# EAGLE design TinkerAccess RFID Adapter (EAGLE 9.6.2)
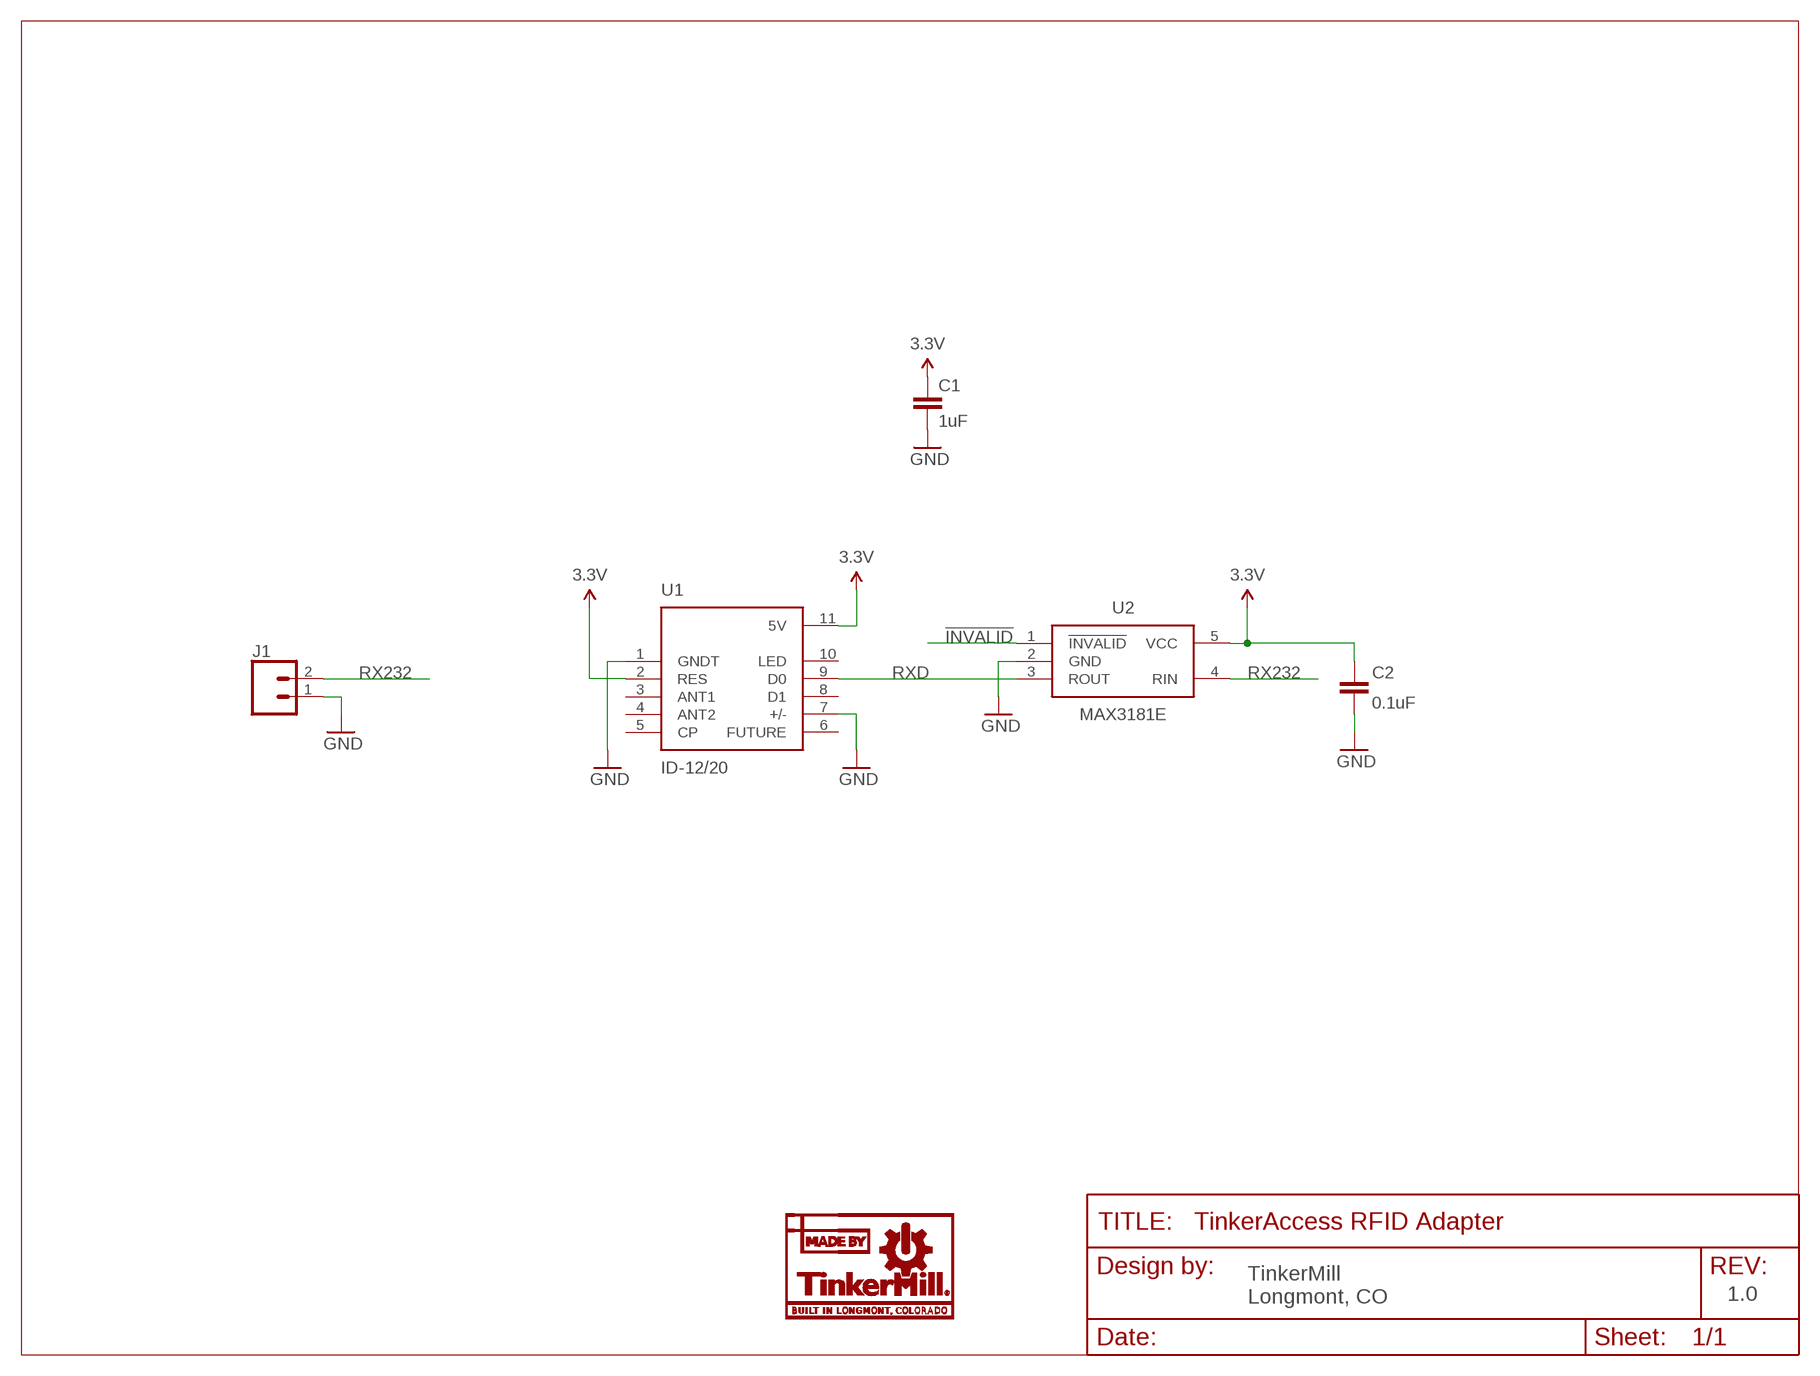
[diagram p0: schematic, sheet 1]

## Parts
C1  1uF  10UF-0603-6.3V-20%  [0603]
C2  0.1uF  0.1UF-0603-25V-(+80/-20%)  [0603]
J1  CONN_025MM  [SCREWTERMINAL-5MM-2]
LOGO1  MADE_BY_TINKERMILL  [MADE_BY_TINKERMILL]
U1  ID-12/20  [ID-12]
U2  MAX3181E  MAX3181E_SOT23-5  [SOT23-5]

## Nets
3.3V: C1.1 C2.2 U1.2(RES) U1.11(5V) U2.5(VCC)
!INVALID: U2.1(!INVALID)
GND: C1.2 C2.1 J1.1 U1.1(GNDT) U1.7(+/-) U2.2(GND)
RX232: J1.2 U2.4(RIN)
RXD: U1.9(D0) U2.3(ROUT)
Unconnected: U1.3(ANT1) U1.4(ANT2) U1.5(CP) U1.6(FUTURE) U1.8(D1) U1.10(LED)

## Notes on the sheet
- TinkerMill
  Longmont, CO
- 1.0

## Library data of the parts
C1 = SparkFun-Capacitors:10UF: 10.0µF ceramic capacitors A capacitor is a passive two-terminal electrical component used to store electrical energy temporarily in an electric field.; PROD_ID: CAP-11015; VALUE: 10uF
C2 = SparkFun-Capacitors:0.1UF: 0.1µF ceramic capacitors A capacitor is a passive two-terminal electrical component used to store electrical energy temporarily in an electric field.; PROD_ID: CAP-00810; SPICEPREFIX: C
J1 = SparkFun-Connectors:CONN_02: Multi connection point. Often used as Generic Header-pin footprint for 0.1 inch spaced/style header connections On any of the 0.1 inch spaced packages, you can populate with these: Break Away Headers - Straight <https://www.sparkfun.com/products/116> (PRT-00116) Break Away Male Headers - Right Angle <https://www.sparkfun.com/products/553> (PRT-00553) Female Headers <https://www.sparkfun.com/products/115> (PRT-00115) Break Away Headers - Machine Pin <https://www.sparkfun.com/products/117> (PRT-00117) Break Away Female Headers - Swiss Machine Pin <https://www.sparkfun.com/products/743> (PRT-00743) For SCREWTERMINALS and SPRING TERMINALS visit here: Screw Terimnals on SparkFun.com <https://www.sparkfun.com/search/results?term=Screw+Terminals> (5mm/3.5mm/2.54mm spacing) This device is also useful as a general connection point to wire up your design to another part of your project. Our various solder wires solder well into these plated through hole pads. Hook-Up Wire - Assortment (Stranded, 22 AWG) <https://www.sparkfun.com/products/11375> (PRT-11375) Hook-Up Wire - Assortment (Solid Core, 22 AWG) <https://www.sparkfun.com/products/11367> (PRT-11367) View the entire wire category on our website here <https://www.sparkfun.com/categories/141> Special notes: Molex polarized connector foot print use with: PRT-08233 with associated crimp pins and housings. 2.54_SCREWTERM for use with PRT-10571. 3.5mm Screw Terminal footprints for PRT-08084 5mm Screw Terminal footprints for use with PRT-08432; SF_SKU: PRT-08432
LOGO1 = TinkerMill:MADE_BY_TINKERMILL
U1 = SparkFun-RF:ID-12/20: RFID reader for ID2, ID12, and ID20 Package
U2 = TMF_ICs:MAX3181E; SPICEPREFIX: X

## Board
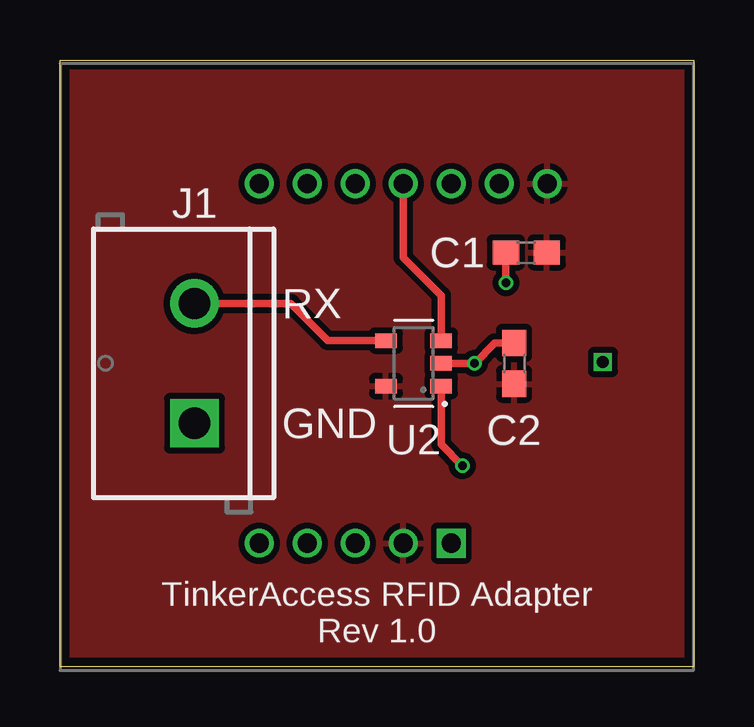
[diagram p1: board, top side]
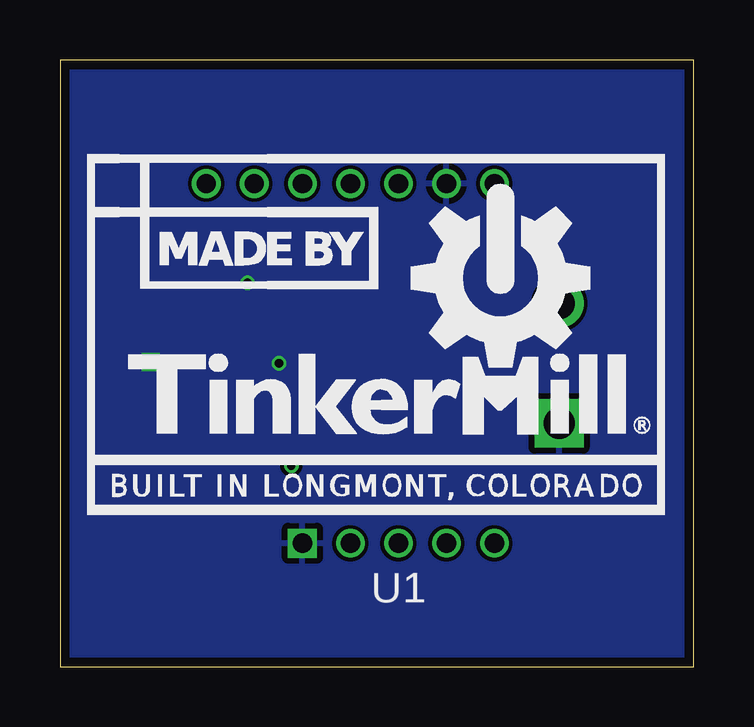
[diagram p2: board, bottom side, seen from below]

Size 26.4 x 25.3 mm. Coordinates in mm from the lower left corner, seen from the top.
Outline: 0,0 0,25.3 26.4,25.3 26.4,0 0,0
Copper layers (1*16): Top 0.035559375mm / dielectric 1.6mm / Bottom 0.035559375mm
Design rules "oshpark-2layer": minimum track width 6mil, minimum drill 10mil, track to track 6mil, track to pad 6mil, pad to pad 6mil, via to via 6mil, smd to smd 6mil, copper to edge 15mil, drill to drill 6mil, minimum pad ring 5mil, minimum via ring 5mil, stop-mask expansion 2.5mil, vias tented up to drill 0mil, thermal gap 10mil

### Footprints (pad centres in the part's own frame; a part is rotated, then mirrored left to right if it is on the bottom)
0603 = smd 1.1 x 1: 1 -0.85,0; 2 0.85,0
SCREWTERMINAL-5MM-2 = drill 1.3 pad 2.032 square: 1 0,0 | drill 1.3 pad 2.032: 2 5,0
ID-12 = drill 0.8 square: 1 16.255,5.32 | drill 0.8: 2 14.255,5.32; 3 12.255,5.32; 4 10.255,5.32; 5 8.255,5.32; 6 8.255,20.32; 7 10.255,20.32; 8 12.255,20.32; 9 14.255,20.32; 10 16.255,20.32; 11 20.255,20.32
SOT23-5 = smd 0.6 x 0.9: 1 -0.95,-1.15; 2 0,-1.15; 3 0.95,-1.15; 4 0.95,1.15; 5 -0.95,1.15

### Placement (x,y rotation side)
C1  19.43,17.27 180 top
C2  18.92,12.65 270 top
J1  5.6,10.15 90 top
LOGO1  25.27,6.35 0 bottom
U1  0.04,-0.17 0 top
U2  14.73,12.65 90 top

### Tracks (layer width: path | path; a pad name or v marks a point on that pad's centre or on a via)
3.3V
  pour Top (isolate 0.254): 0,0 0,25.3 26.4,25.3 26.4,0
!INVALID  (via drill 0.35)
  Top 0.305: U2.1 15.88,9.26 v16.76,8.38
GND  (via drill 0.35, 0.5 pad 0.55)
  Top 0.305: U2.2 v17.27,12.65 18.12,13.5 C2.1 | C1.2 v18.58,16
  other vias: 22.62,12.71
  pour Bottom: 0,0 0,25.3 26.4,25.3 26.4,0
N$4  (via drill 0.8)
  other vias: 18.3,20.15
RX232
  Top 0.305: U2.4 11.16,13.6 9.62,15.15 J1.2
RXD
  Top 0.305: U2.3 15.88,15.49 14.3,17.07 U1.9

### Text on the board
tPlace: RX | GND | TinkerAccess RFID Adapter / Rev 1.0